# Altium schematic sheet Motor_Driver1.SchDoc
size A4; SheetNumber: 4; SheetTotal: 8
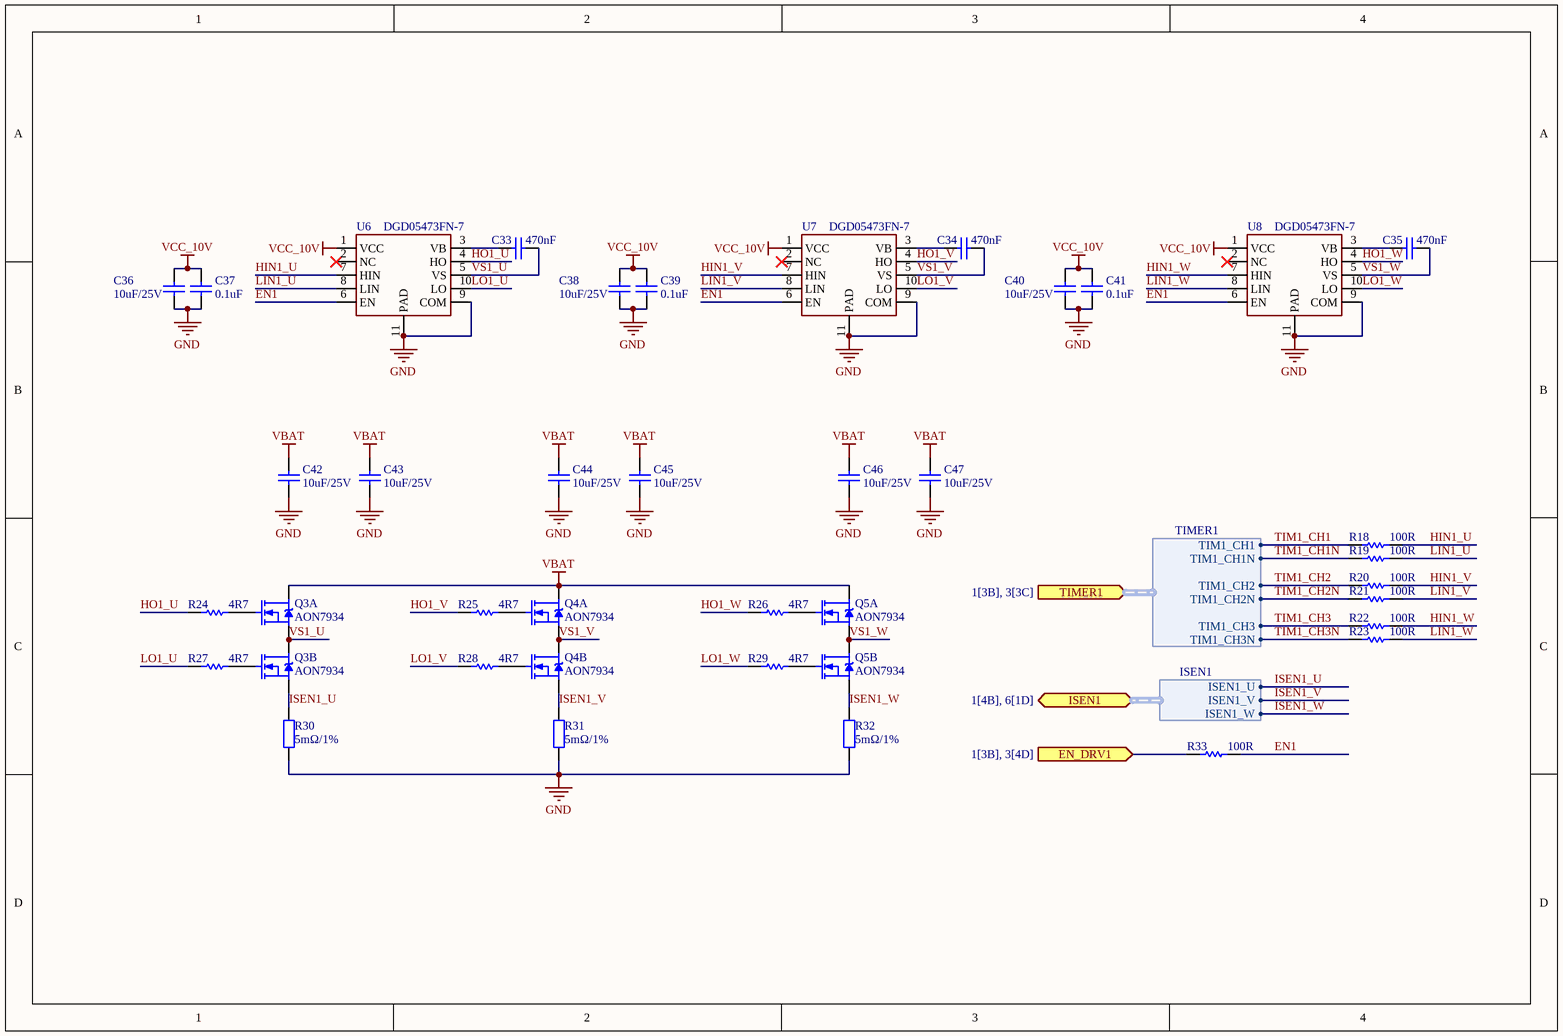
[diagram p0: Motor_Driver1.SchDoc]

## Parts
C33  470nF  [C0603_NS]
C34  470nF  [C0603_NS]
C35  470nF  [C0603_NS]
C36  10uF/25V  [C0603_NS]
C37  0.1uF  [C0603_NS]
C38  10uF/25V  [C0603_NS]
C39  0.1uF  [C0603_NS]
C40  10uF/25V  [C0603_NS]
C41  0.1uF  [C0603_NS]
C42  10uF/25V  [C0603_NS]
C43  10uF/25V  [C0603_NS]
C44  10uF/25V  [C0603_NS]
C45  10uF/25V  [C0603_NS]
C46  10uF/25V  [C0603_NS]
C47  10uF/25V  [C0603_NS]
Q3  AON7934  [POWERPAIR_3X3]  (parts A,B of 2)
Q4  AON7934  [POWERPAIR_3X3]  (parts A,B of 2)
Q5  AON7934  [POWERPAIR_3X3]  (parts A,B of 2)
R18  100R  [R0603_NS]
R19  100R  [R0603_NS]
R20  100R  [R0603_NS]
R21  100R  [R0603_NS]
R22  100R  [R0603_NS]
R23  100R  [R0603_NS]
R24  4R7  [R0603_NS]
R25  4R7  [R0603_NS]
R26  4R7  [R0603_NS]
R27  4R7  [R0603_NS]
R28  4R7  [R0603_NS]
R29  4R7  [R0603_NS]
R30  5mΩ/1%  [R1206_NS]
R31  5mΩ/1%  [R1206_NS]
R32  5mΩ/1%  [R1206_NS]
R33  100R  [R0603_NS]
U6  DGD05473FN-7  [W-DFN3030-10_DGD05473]
U7  DGD05473FN-7  [W-DFN3030-10_DGD05473]
U8  DGD05473FN-7  [W-DFN3030-10_DGD05473]

## Ports
EN_DRV1 (in, see 1[3B], 3[4D]), ISEN1 (bidir, harness ISEN1, see 1[4B], 6[1D]), TIMER1 (in, harness TIMER1, see 1[3B], 3[3C])

## Harnesses
TIMER1: TIM1_CH1, TIM1_CH2, TIM1_CH3, TIM1_CH1N, TIM1_CH2N, TIM1_CH3N
ISEN1: ISEN1_U, ISEN1_V, ISEN1_W

## Nets
GND: C36.2 C37.2 C38.2 C39.2 C40.2 C41.2 C42.1 C43.1 C44.1 C45.1 C46.1 C47.1 R30.1 R31.1 R32.1 U6.9(COM) U6.11(PAD) U7.9(COM) U7.11(PAD) U8.9(COM) U8.11(PAD)
VBAT: C42.2 C43.2 C44.2 C45.2 C46.2 C47.2 Q3.D1 Q4.D1 Q5.D1
VCC_10V: C36.1 C37.1 C38.1 C39.1 C40.1 C41.1 U6.1(VCC) U7.1(VCC) U8.1(VCC)
EN1: R33.2 U6.6(EN) U7.6(EN) U8.6(EN)
EN_DRV1: R33.1 ; port EN_DRV1
HIN1_U: R18.2 U6.7(HIN)
HIN1_V: R20.2 U7.7(HIN)
HIN1_W: R22.2 U8.7(HIN)
HO1_U: R24.1 U6.4(HO)
HO1_V: R25.1 U7.4(HO)
HO1_W: R26.1 U8.4(HO)
ISEN1_U: Q3.S2 R30.2 ; port ISEN1.ISEN1_U
ISEN1_V: Q4.S2 R31.2 ; port ISEN1.ISEN1_V
ISEN1_W: Q5.S2 R32.2 ; port ISEN1.ISEN1_W
LIN1_U: R19.2 U6.8(LIN)
LIN1_V: R21.2 U7.8(LIN)
LIN1_W: R23.2 U8.8(LIN)
LO1_U: R27.1 U6.10(LO)
LO1_V: R28.1 U7.10(LO)
LO1_W: R29.1 U8.10(LO)
TIM1_CH1: R18.1 ; port TIMER1.TIM1_CH1
TIM1_CH1N: R19.1 ; port TIMER1.TIM1_CH1N
TIM1_CH2: R20.1 ; port TIMER1.TIM1_CH2
TIM1_CH2N: R21.1 ; port TIMER1.TIM1_CH2N
TIM1_CH3: R22.1 ; port TIMER1.TIM1_CH3
TIM1_CH3N: R23.1 ; port TIMER1.TIM1_CH3N
VS1_U: C33.2 Q3.S1/D2 U6.5(VS)
VS1_V: C34.2 Q4.S1/D2 U7.5(VS)
VS1_W: C35.2 Q5.S1/D2 U8.5(VS)
NetC33_1: C33.1 U6.3(VB)
NetC34_1: C34.1 U7.3(VB)
NetC35_1: C35.1 U8.3(VB)
NetQ3_G1: Q3.G1 R24.2
NetQ3_G2: Q3.G2 R27.2
NetQ4_G1: Q4.G1 R25.2
NetQ4_G2: Q4.G2 R28.2
NetQ5_G1: Q5.G1 R26.2
NetQ5_G2: Q5.G2 R29.2

Not connected (* = marked no-connect by the designer): U6 2(NC)*; U7 2(NC)*; U8 2(NC)*

## Library data of the parts
C33-C41 = Cap: Capacitor; Value: 1uF; Published: 8-Jun-2000; LatestRevisionDate: 17-Jul-2002; LatestRevisionNote: Re-released for DXP Platform.; PackageReference: RAD-0.3; Publisher: Altium Limited; PackageDescription: Radial Cap, Thru-Hole; 2 Leads; 0.3 in Pin Spacing
C42-C47 = Cap: Capacitor
R18-R29 R33 = Res1: Resistor
R30-R32 = Res2: Resistor; Value: 15mΩ; Published: 8-Jun-2000; LatestRevisionDate: 17-Jul-2002; LatestRevisionNote: Re-released for DXP Platform.; PackageReference: AXIAL-0.4; Publisher: Altium Limited; PackageDescription: Axial Device, Thru-Hole; 2 Leads; 0.4 in Pin Spacing
U6-U8 = DGD05473